# EAGLE design BOBORESP32S (EAGLE 7.6.0)
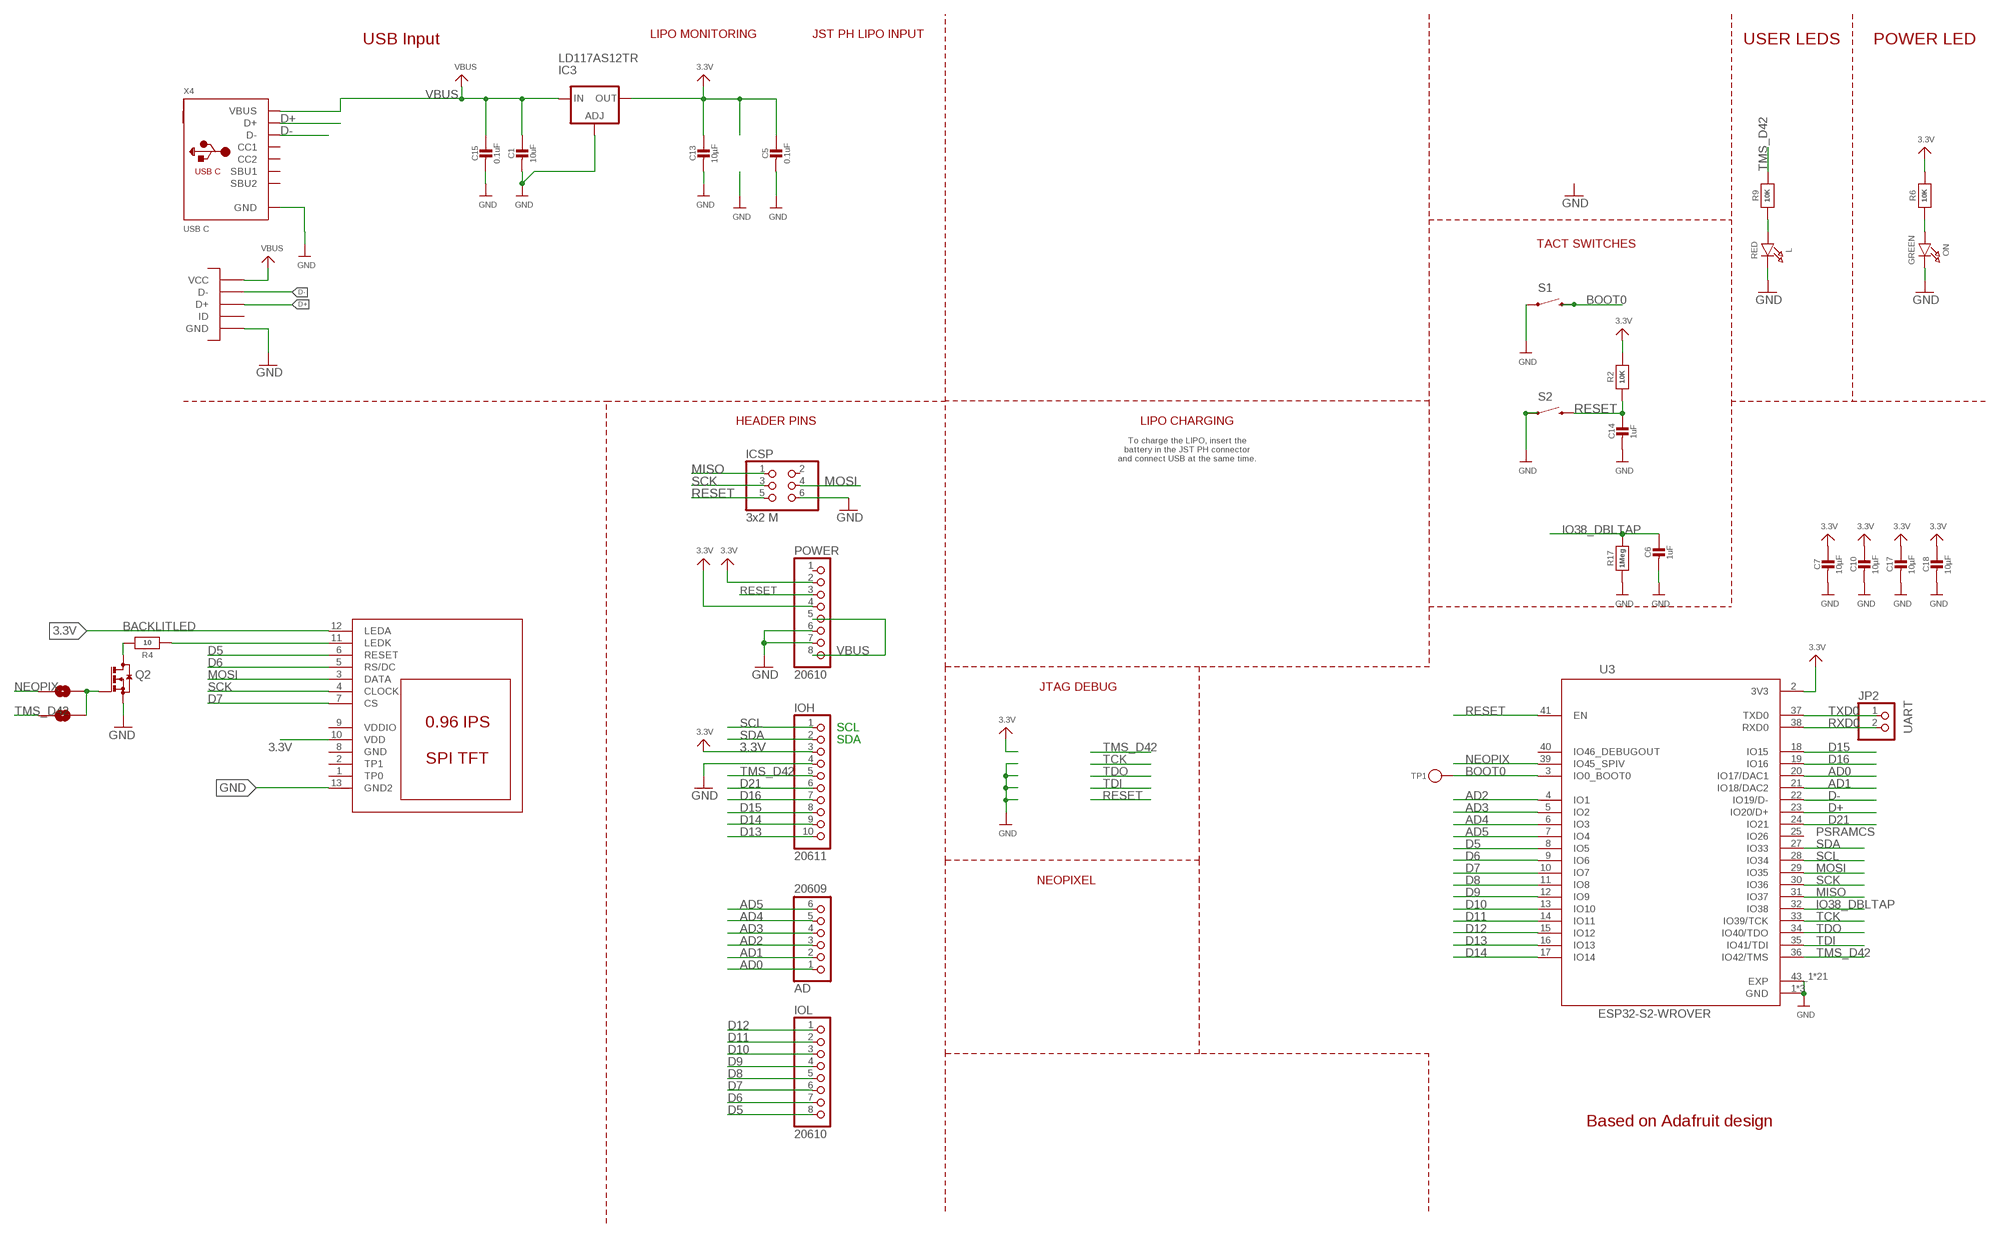
[diagram p0: schematic, sheet 1]

## Parts
AD  20609  HEADER-1X6OVALWAVE  [1X06_OVALWAVE]
C1  10uF  CAP_CERAMIC_0805  [_0805]
C5  0.1uF  CAP_CERAMIC_0805  [_0805]
C6  1uF  CAP_CERAMIC_0603  [_0603]
C7  10µF  CAP_CERAMIC_0805  [_0805]
C10  10µF  CAP_CERAMIC_0805  [_0805]
C13  10µF  CAP_CERAMIC_0805  [_0805]
C14  1uF  CAP_CERAMIC_0603  [_0603]
C15  0.1uF  CAP_CERAMIC_0603  [_0603]
C17  10µF  CAP_CERAMIC_0805  [_0805]
C18  10µF  CAP_CERAMIC_0805  [_0805]
IC3  LD117AS12TR  [SOT223]
ICSP  3x2 M  HEADER-2X3  [2X03_ROUND_70MIL]
IOH  20611  HEADER-1X10OVALWAVE  [1X10_OVALWAVE]
IOL  20610  HEADER-1X8OVALWAVE  [1X08_OVALWAVE]
JP2  UART  HEADER-1X2ROUND  [1X02_ROUND]
JUMPER1  SOLDERJUMPERTRACE  [SJ_2S-TRACE]
JUMPER2  SOLDERJUMPERNC2  [SJ_2S-NOTRACE]
L  RED  LED0603_NOOUTLINE  [CHIPLED_0603_NOOUTLINE]
ON  GREEN  LED0603_NOOUTLINE  [CHIPLED_0603_NOOUTLINE]
POWER  20610  HEADER-1X8OVALWAVE  [1X08_OVALWAVE]
Q2  BSS123  [SOT23]
R2  10K  RESISTOR_0603_NOOUT  [0603-NO]
R4  10  RESISTOR_0603_NOOUT  [0603-NO]
R6  10K  RESISTOR_0603_NOOUT  [0603-NO]
R9  10K  RESISTOR_0603_NOOUT  [0603-NO]
R17  1Meg  RESISTOR_0603_NOOUT  [0603-NO]
S1  SWITCH-MOMENTARY-2PTH  [TACTILE-PTH]
S2  SWITCH-MOMENTARY-2PTH  [TACTILE-PTH]
TP1  TESTPOINTROUND1.5MMNO  [TESTPOINT_ROUND_1.5MM_NO]
U3  ESP32-S2-WROVER  [MODULE_ESP32-S2-WROVER]
U$5  MICROUSB  [MICRO_B]
U$9  DISP_LCD_0.9IN_160X80  [TFT_0.96IN_160X80B]
X4  USB C  USB_C  [USB_C_CUSB31-CFM2AX-01-X]

## Nets
3.3V [Power]: C5.1 C7.1 C10.1 C13.1 C17.1 C18.1 IC3.4(OUT) IOH.3 POWER.2 POWER.4 R2.2 R6.2 U3.2(3V3) U$9.10(VDD) U$9.12(LEDA)
AD0: AD.1 U3.20(IO17/DAC1)
AD1: AD.2 U3.21(IO18/DAC2)
AD2: AD.3 U3.4(IO1)
AD3: AD.4 U3.5(IO2)
AD4: AD.5 U3.6(IO3)
AD5: AD.6 U3.7(IO4)
BACKLITLED: R4.1 U$9.11(LEDK)
BOOT0: S1.3 TP1.P$1 U3.3(IO0_BOOT0)
D5: IOL.8 U3.8(IO5) U$9.6(RESET)
D6: IOL.7 U3.9(IO6) U$9.5(RS/DC)
D7: IOL.6 U3.10(IO7) U$9.7(CS)
D8: IOL.5 U3.11(IO8)
D9: IOL.4 U3.12(IO9)
D10: IOL.3 U3.13(IO10)
D11: IOL.2 U3.14(IO11)
D12: IOL.1 U3.15(IO12)
D13: IOH.10 U3.16(IO13)
D14: IOH.9 U3.17(IO14)
D15: IOH.8 U3.18(IO15)
D16: IOH.7 U3.19(IO16)
D21: IOH.6 U3.24(IO21)
D+: U3.23(IO20/D+) U$5.P3(D+) X4.A6(D+) X4.B6(D+)
D-: U3.22(IO19/D-) U$5.P2(D-) X4.A7(D-) X4.B7(D-)
DISPBL: JUMPER1.1 JUMPER2.1 Q2.1(G)
GND [lowpower]: C1.2 C5.2 C6.2 C7.2 C10.2 C13.2 C14.2 C15.2 C17.2 C18.2 IC3.1(ADJ) ICSP.6 IOH.4 L.C ON.C POWER.6 POWER.7 Q2.2(S) R17.1 S1.1 S2.1 U3.1(GND) U3.26(GND) U3.42(GND) U3.43_1(EXP) U3.43_2(EXP) U3.43_3(EXP) U3.43_4(EXP) U3.43_5(EXP) U3.43_6(EXP) U3.43_7(EXP) U3.43_8(EXP) U3.43_9(EXP) U3.43_10(EXP) U3.43_11(EXP) U3.43_12(EXP) U3.43_13(EXP) U3.43_14(EXP) U3.43_15(EXP) U3.43_16(EXP) U3.43_17(EXP) U3.43_18(EXP) U3.43_19(EXP) U3.43_20(EXP) U3.43_21(EXP) U$5.GND1(GND) U$5.GND2(GND) U$5.GND3(GND) U$5.GND4(GND) U$5.GND7(GND) U$5.GND8(GND) U$5.P5(GND) U$9.13(GND2) X4.A1B12(GND) X4.B1A12(GND)
IO38_DBLTAP: C6.1 R17.2 U3.32(IO38)
MISO: ICSP.1 U3.31(IO37)
MOSI: ICSP.4 U3.29(IO35) U$9.3(DATA)
N$1: L.A R9.1
N$2: Q2.3(D) R4.2
N$3: ON.A R6.1
NEOPIX: JUMPER2.2 U3.39(IO45_SPIV)
RESET: C14.1 ICSP.5 POWER.3 R2.1 S2.3 U3.41(EN)
RXD0: JP2.2 U3.38(RXD0)
SCK: ICSP.3 U3.30(IO36) U$9.4(CLOCK)
SCL: IOH.1 U3.28(IO34)
SDA: IOH.2 U3.27(IO33)
TCK: U3.33(IO39/TCK)
TDI: U3.35(IO41/TDI)
TDO: U3.34(IO40/TDO)
TMS_D42: IOH.5 JUMPER1.2 R9.2 U3.36(IO42/TMS)
TXD0: JP2.1 U3.37(TXD0)
VBUS: C1.1 C15.1 IC3.3(IN) POWER.5 POWER.8 U$5.P1(VCC) X4.A4B9(VBUS) X4.B4A9(VBUS)
Unconnected: ICSP.2 POWER.1 U3.25(IO26) U3.40(IO46_DEBUGOUT) U$5.P4(ID) U$9.1(TP0) U$9.2(TP1) X4.A5(CC1) X4.A8(SBU1) X4.B5(CC2) X4.B8(SBU2)

## Notes on the sheet
- USB Input | LIPO MONITORING | JST PH LIPO INPUT | USER LEDS | POWER LED
- TACT SWITCHES
- HEADER PINS | LIPO CHARGING
- To charge the LIPO, insert the
  battery in the JST PH connector
  and connect USB at the same time.
- JTAG DEBUG
- SCL
- SDA
- PSRAMCS
- NEOPIXEL
- Based on Adafruit design

## Power pins joined to a net without a drawn wire
GND: U$9.8(GND)
VDDIO: U$9.9(VDDIO)

## Library data of the parts
AD = microbuilder:HEADER-1X6: PIN HEADER
C1 C5-C7 C10 C13-C15 C17 C18 = microbuilder:CAP_CERAMIC: Ceramic Capacitors For new designs, use the packages preceded by an '_' character since they are more reliable: The following footprints should be used on most boards: _0402 - Standard footprint for regular board layouts _0603 - Standard footprint for regular board layouts _0805 - Standard footprint for regular board layouts _1206 - Standard footprint for regular board layouts For extremely tight-pitch boards where space is at a premium, the following 'micro-pitch' footprints can be used (smaller pads, no silkscreen outline, etc.): _0402MP - Micro-pitch footprint for very dense/compact boards _0603MP - Micro-pitch footprint for very dense/compact boards _0805MP - Micro-pitch footprint for very dense/compact boards _1206MP - Micro-pitch footprint for very dense/compact boards
IC3 = v-reg:LD117A?*: Low drop fixed and adjustable positive voltage regulators 1 A Source: http://www.st.com/stonline/products/literature/ds/7194/ld1117axx.pdf
ICSP = microbuilder:HEADER-2X3: PIN HEADER
IOH = microbuilder:HEADER-1X10: PIN HEADER
IOL POWER = microbuilder:HEADER-1X8: PIN HEADER
JP2 = microbuilder:HEADER-1X2: PIN HEADER
JUMPER1 JUMPER2 = SparkFun:SOLDERJUMPER: Solder Jumper Standard SMD solder jumper. Used to automate production. Two varients : Normally Open and Normally Closed are the same, but have different paste layers. NC will have a large amount of paste and should jumper during reflow.
L ON = microbuilder:LED: LED 0603 - 0603 Surface Mount Package 2mA: Green LED - Low Power (3.9mcd, 2ma, 1.7Vf) - Digikey: 475-2709-2-ND Orange LED - Low Power (9.8mcd, 2ma, 1.8Vf) - Digikey: 475-1194-2-ND Red LED - Low Power (5mcd, 2ma, 1.8Vf) - Digikey: 475-1195-2-ND Yellow LED - Low Power (7mcd, 2ma, 1.8Vf) - Digikey: 475-1196-2-ND 5mA: Blue LED - Low Power (17mcd, 5ma, 2.9Vf) - Digikey: LNJ937W8CRACT-ND 0805 - 0805 Surface Mount Package 2mA: Red LED (8.8mcd, 2mA, 1.8Vf, Clear) - Low Power [Digikey: 475-2510-1-ND] Green LED (5mcd, 2mA, 1.8Vf, Clear) - Low Power [Digikey: 475-2730-1-ND] Yellow LED (11.3mcd, 2mA, 1.8Vf, Clear) - Low Power [Digikey: 475-2555-1-ND] 20mA: Red LED (104mcd, 20mA, Diffused) - LS R976 [Digikey: 475-1278-6-ND] Red LED (12mcd, 20mA, 2.0Vf, Clear) - APT2012EC [Digikey: 754-1128-1-ND] Green LED (15mcd, 20mA, 2.2Vf, Clear) - APT2012GC [Digikey: 754-1131-1-ND] Orange LED (160mcd, 20mA, 2.1Vf, Clear) - APT2012SECK [Digikey: 754-1130-1-ND] 1206 - 1206 Surface Mount Package Green LED (26mcd, 20mA, Diffused) - LG N971 [Digikey: 475-1407-6-ND] Red LED (15mcd, 20mA, Diffused) - LH N974 [Digikey: 475-1416-6-ND] Cree - Cree High-Power Surface Mount LEDs XPEBWT-L1-0000-00D50 - White 111lm 350mA 2.9Vf 6200K 110° XTEAWT-00-0000-00000LEE3 - White 114lm 350mA 2.85Vf 5000K 115° Everlight - Everlight 45-21 Series Surface Mount LEDs 45-21/QK2C-B2832AC2CB2/2T - Warm White 2000mcd 20mA 3.25Vf 3050K 120° 45-21/LK2C-B38452C4CB2/2T - Nuetral White 2000mcd 20mA 3.25Vf 4150K 120° 45-21/LK2C-B50634C6CB2/2T - Cold White 2200mcd 20mA 3.25Vf 5650K 120° PLCC2 Reverse Mount LS T77K-J1L2-1-0-2-R18-Z - Red 11.25mcd 2mA 1.8Vf 630nm 120° LO T77K-L1M2-24-Z - Orange 19.6mcd 2mA 1.8Vf 606nm 120° LY T77K-K2M1-26-Z - Yellow 15.7mcd 2mA 1.8Vf 587nm 120°
Q2 = transistor-small-signal:BSS123: N-CHANNEL MOS FET
R2 R4 R6 R9 R17 = microbuilder:RESISTOR: Resistors For new designs, use the packages preceded by an '_' character since they are more reliable: The following footprints should be used on most boards: _0402 - Standard footprint for regular board layouts _0603 - Standard footprint for regular board layouts _0805 - Standard footprint for regular board layouts _1206 - Standard footprint for regular board layouts For extremely tight-pitch boards where space is at a premium, the following 'micro-pitch' footprints can be used (smaller pads, no silkscreen outline, etc.): _0402MP - Micro-pitch footprint for very dense/compact boards _0603MP - Micro-pitch footprint for very dense/compact boards _0805MP - Micro-pitch footprint for very dense/compact boards _1206MP - Micro-pitch footprint for very dense/compact boards
S1 S2 = SparkFun-Electromechanical:SWITCH-MOMENTARY-2: Various NO switches- pushbuttons, reed, etc; PROD_ID: SWCH-08441
TP1 = microbuilder:TESTPOINT: Test Point Various test points for characterisation and PCB testing TESTPOINT_SMT - Compact Surface Mount Test Point [Digikey: 5016KTR-ND]
U3 = adafruit_wireless:ESP32-S2-WROVER: WiFi 802.11b/g/n Transceiver Module 2.4GHz Antenna Not Included Surface Mount Check prices <https://snapeda.com/parts/ESP32-S2-WROVER/Espressif%20Systems/view-part/?ref=eda>; AVAILABILITY: Warning; DESCRIPTION: WiFi 802.11b/g/n Transceiver Module 2.4GHz Antenna Not Included Surface Mount; DIGIKEY-PURCHASE-URL: https://snapeda.com/shop?store=DigiKey&id=4614060; MF: Espressif Systems; MP: ESP32-S2-WROVER; PACKAGE: VFQFN-56 Espressif Systems; PRICE: None
U$5 = Other:MICROUSB
U$9 = ips096bottom:DISP_LCD_0.9IN_160X80
X4 = microbuilder:USB_C: USB Type-C USB 2.0 Connector

## Net classes
2 lowpower: width 0.305 mm, drill 0.483 mm
3 Power: width 0.305 mm, drill 0.483 mm

## Board
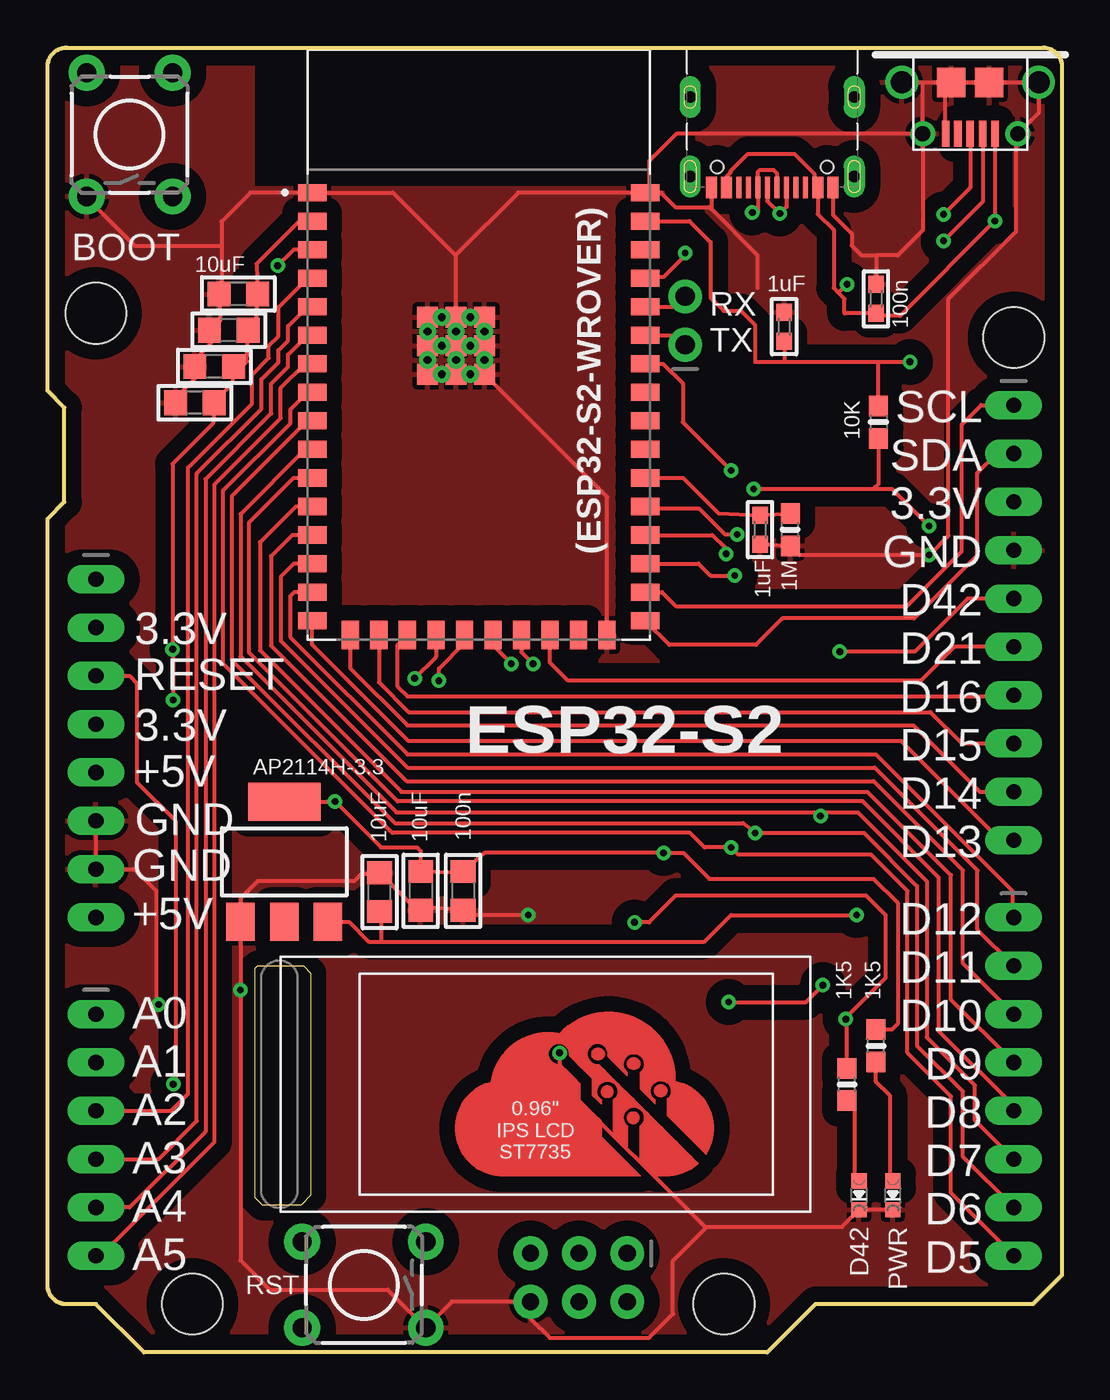
[diagram p1: board, top side]
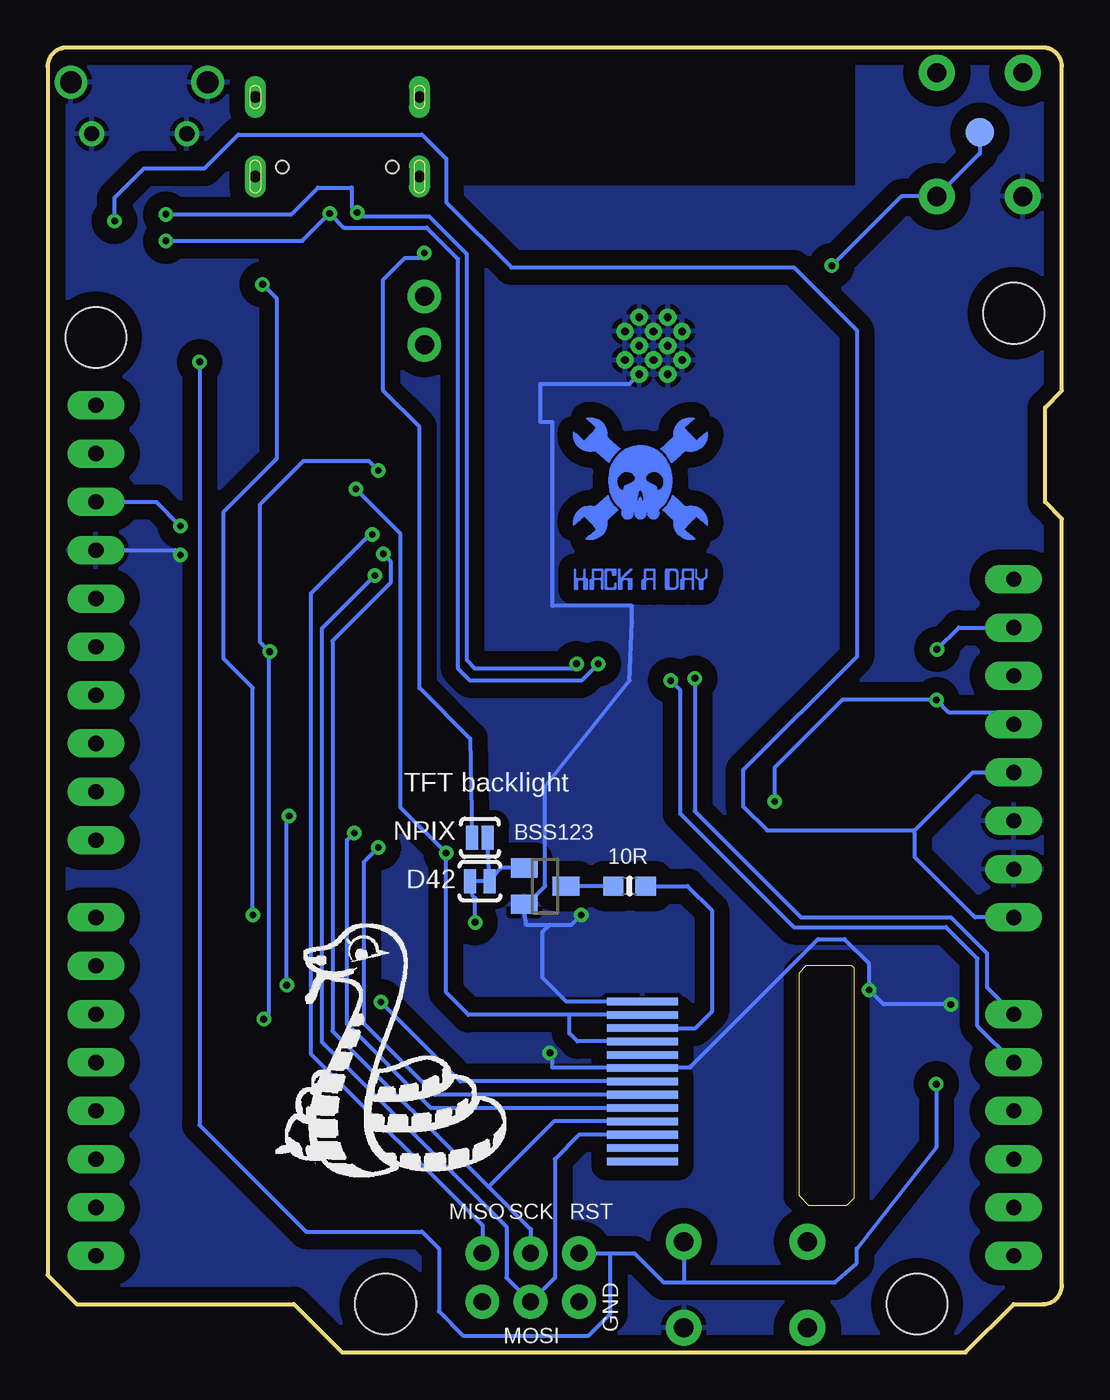
[diagram p2: board, bottom side, seen from below]

Size 53.34 x 68.58 mm. Coordinates in mm from the lower left corner, seen from the top.
Outline: 53.34,4.06 51.82,2.54 40.39,2.54 37.85,0 5.08,0 2.54,2.54 1,2.54 arc-90 0,3.54 0,43.81 0.89,44.7 0.89,49.66 0,50.55 0,67.58 arc-90 1,68.58 52.34,68.58 arc-90 53.34,67.58 53.34,4.06
Outline: 11.05,20.32 13.46,20.32 13.84,19.94 13.84,8.25 13.33,7.75 11.3,7.75 10.92,8.13 10.92,20.19 11.05,20.32
Copper layers (1*16): Top 0.035mm / dielectric 1.5mm / Bottom 0.035mm
Design rules "adafruit *": minimum track width 8mil, minimum drill 15.5mil, track to track 8mil, track to pad 8mil, pad to pad 8mil, via to via 8mil, smd to smd 8mil, copper to edge 10mil, drill to drill 8mil, minimum pad ring 10mil, minimum via ring 8mil, stop-mask expansion 2mil, vias tented up to drill 20mil, thermal gap 10mil
Holes 3.2 mm at 35.56,2.54 7.62,2.54 50.8,53.34 2.54,54.61

### Footprints (pad centres in the part's own frame; a part is rotated, then mirrored left to right if it is on the bottom)
1X06_OVALWAVE = drill 0.8 pad 1.5 long: 1 -6.35,0; 2 -3.81,0; 3 -1.27,0; 4 1.27,0; 5 3.81,0; 6 6.35,0
_0805 = smd 1.2 x 1.3: 1 -1.016,0; 2 1.016,0
_0603 = smd 0.9 x 0.8: 1 -0.762,0; 2 0.762,0
SOT223 = smd 1.5 x 2: 1 -2.3,-3.15; 2 0,-3.15; 3 2.3,-3.15 | smd 3.8 x 2: 4 0,3.15
2X03_ROUND_70MIL = drill 0.9 pad 1.778: 1 -2.54,-1.27; 2 -2.54,1.27; 3 0,-1.27; 4 0,1.27; 5 2.54,-1.27; 6 2.54,1.27
1X10_OVALWAVE = drill 0.8 pad 1.5 long: 1 -11.43,0; 2 -8.89,0; 3 -6.35,0; 4 -3.81,0; 5 -1.27,0; 6 1.27,0; 7 3.81,0; 8 6.35,0; 9 8.89,0; 10 11.43,0
1X08_OVALWAVE = drill 0.8 pad 1.5 long: 1 -8.89,0; 2 -6.35,0; 3 -3.81,0; 4 -1.27,0; 5 1.27,0; 6 3.81,0; 7 6.35,0; 8 8.89,0
1X02_ROUND = drill 1 pad 1.778: 1 -1.27,0; 2 1.27,0
SJ_2S-TRACE = smd 0.635 x 1.27: 1 -0.508,0; 2 0.508,0
SJ_2S-NOTRACE = smd 0.635 x 1.27: 1 -0.401,0; 2 0.413,0
CHIPLED_0603_NOOUTLINE = smd 0.8 x 0.8: A 0,-0.75; C 0,0.75
SOT23 = smd 1 x 1.4: 1 -0.95,-1.1; 2 0.95,-1.1; 3 0,1.1
0603-NO = smd 1.075 x 1: 1 -0.85,0; 2 0.85,0
TACTILE-PTH = drill 1.016 pad 1.88: 1 -3.251,2.261; 2 3.251,2.261; 3 -3.251,-2.261; 4 3.251,-2.261
TESTPOINT_ROUND_1.5MM_NO = smd 1.5 x 1.5: P$1 0,0
MODULE_ESP32-S2-WROVER = smd 1.5 x 0.9: 1 -8.75,8; 2 -8.75,6.5; 3 -8.75,5; 4 -8.75,3.5; 5 -8.75,2; 6 -8.75,0.5; 7 -8.75,-1; 8 -8.75,-2.5; 9 -8.75,-4; 10 -8.75,-5.5; 11 -8.75,-7; 12 -8.75,-8.5; 13 -8.75,-10; 14 -8.75,-11.5; 15 -8.75,-13; 16 -8.75,-14.5; 27 8.75,-14.5; 28 8.75,-13; 29 8.75,-11.5; 30 8.75,-10; 31 8.75,-8.5; 32 8.75,-7; 33 8.75,-5.5; 34 8.75,-4; 35 8.75,-2.5; 36 8.75,-1; 37 8.75,0.5; 38 8.75,2; 39 8.75,3.5; 40 8.75,5; 41 8.75,6.5; 42 8.75,8 | smd 0.9 x 1.5: 17 -6.75,-15.25; 18 -5.25,-15.25; 19 -3.75,-15.25; 20 -2.25,-15.25; 21 -0.75,-15.25; 22 0.75,-15.25; 23 2.25,-15.25; 24 3.75,-15.25; 25 5.25,-15.25; 26 6.75,-15.25 | smd 1.1 x 1.1: 43_1 -2.69,1.45; 43_2 -1.19,1.45; 43_3 0.31,1.45; 43_4 -2.69,-0.05; 43_5 -1.19,-0.05; 43_6 0.31,-0.05; 43_7 -2.69,-1.55; 43_8 -1.19,-1.55; 43_9 0.31,-1.55 | drill 0.4: 43_10 -1.94,1.45; 43_11 -0.44,1.45; 43_12 -2.69,0.7; 43_13 -1.19,0.7; 43_14 0.31,0.7; 43_15 -1.94,-0.05; 43_16 -0.44,-0.05; 43_17 -2.69,-0.8; 43_18 -1.19,-0.8; 43_19 0.31,-0.8; 43_20 -1.94,-1.55; 43_21 -0.44,-1.55
MICRO_B = smd 1.5 x 1.55: GND1 -1,1.45; GND2 1,1.45 | drill 0.8: GND3 -2.5,4.15; GND4 2.5,4.15 | drill 1.15: GND7 -3.598,1.45; GND8 3.598,1.45 | smd 0.4 x 1.35: P1 -1.3,4.15; P2 -0.65,4.15; P3 0,4.15; P4 0.65,4.15; P5 1.3,4.15
TFT_0.96IN_160X80B = smd 3.74 x 0.4 bottom: 1 10.5,3.565; 2 10.5,4.265; 3 10.5,4.965; 4 10.5,5.665; 5 10.5,6.365; 6 10.5,7.065; 7 10.5,7.765; 8 10.5,8.465; 9 10.5,9.165; 10 10.5,9.865; 11 10.5,10.565; 12 10.5,11.265; 13 10.5,11.965
USB_C_CUSB31-CFM2AX-01-X = smd 0.575 x 1.15: A1B12 -3.2,3.545; A4B9 -2.4,3.545; B1A12 3.2,3.545; B4A9 2.4,3.545 | smd 0.275 x 1.15: A5 -1.25,3.545; A6 -0.25,3.545; A7 0.25,3.545; A8 1.25,3.545; B5 1.75,3.545; B6 0.75,3.545; B7 -0.75,3.545; B8 -1.75,3.545 | drill 0.6 pad 1 long: M1 -4.32,2.97; M2 4.32,2.97; M3 -4.32,-1.21; M4 4.32,-1.21 | hole 0.65: 2.89,2.47; -2.89,2.47

### Placement (x,y rotation side)
AD  2.54,11.43 270 top
C1  17.46,24.19 90 top
C5  21.84,24.26 270 top
C6  37.46,43.24 270 top
C7  10.03,55.63 180 top
C10  9.53,53.72 180 top
C13  19.62,24.26 270 top
C14  38.73,53.91 90 top
C15  43.56,55.37 90 top
C17  8.76,51.82 180 top
C18  7.75,49.91 180 top
IC3  12.45,25.78 0 top
ICSP  27.94,3.94 180 top
IOH  50.8,38.35 270 top
IOL  50.8,13.97 270 top
JP2  33.53,54.23 90 top
JUMPER1  30.61,24.77 180 bottom
JUMPER2  30.61,27.05 180 bottom
L  42.67,8.25 180 top
ON  44.45,8.25 180 top
POWER  2.54,31.75 270 top
Q2  27.18,24.51 270 bottom
R2  43.69,48.89 270 top
R4  22.73,24.51 180 bottom
R6  43.56,16.12 90 top
R9  42.04,14.08 90 top
R17  39.05,43.24 90 top
S1  4.32,64.01 90 top
S2  16.64,3.56 180 top
TP1  4.32,64.14 0 bottom
U3  22.67,52.96 0 top
U$5  48.51,68.2 180 top
U$9  11.56,6.48 0 top
X4  38.1,64.77 180 top

### Tracks (layer width: path | path; a pad name or v marks a point on that pad's centre or on a via)
3.3V  (via drill 0.36)
  Top 0.203: U3.2 13.23,59.46 10.98,57.21 C7.1 10.98,54.23 C10.1 10.47,52.07 10.22,51.82 C17.1 9.71,50.93 C18.1 8.7,48.83 6.57,46.71 v6.57,36.96 6.6,36.93 v6.6,34.29 | 43.61,17.02 R6.2 44.4,16.97 44.7,17.27 44.7,23.62 43.43,24.89 34.8,24.89 33.44,26.25 v32.38,26.25 22.99,26.25 C5.1 21.49,25.21 C13.1 19.62,26.35 19.43,26.54 17.53,26.54 v15.11,28.96 15.09,28.93 IC3.4 | v37.13,45.38 43.43,45.38 | 43.43,45.38 44.4,45.38 v46.35,43.43 | R2.2 43.69,45.64 43.43,45.38
  Bottom 0.203: v6.57,36.96 5.43,38.1 POWER.2 | POWER.4 3.17,33.65 5.97,33.65 v6.6,34.29 11.56,34.29 15.11,30.73 v15.11,28.96 | IOH.3 47.62,44.7 v46.35,43.43 | v37.13,45.38 34.8,43.05 34.8,28.66 v32.38,26.25 32.38,18.92 31.2,17.74 25.91,17.74 | U$9.12 25.91,17.74 | U$9.10 25.49,16.34 25.91,16.76 25.91,17.74
AD0  (via drill 0.36)
  Top 0.203: v19.3,35.43 20.42,36.55 U3.20
  Bottom 0.203: v19.3,35.43 19.3,28.45 13.72,22.86 5.84,22.86 3.94,20.96 3.94,19.18 AD.1
AD1  (via drill 0.36)
  Top 0.203: U3.21 21.92,37.29 20.57,35.94 v20.57,35.31
  Bottom 0.203: v20.57,35.31 20.07,34.8 20.07,28.32 14.1,22.35 6.1,22.35 4.45,20.7 4.45,17.14 AD.2
AD2
  Top 0.203: AD.3 6.5,12.7 7.39,13.59 7.39,46.51 10.74,49.86 10.74,51.38 11.63,52.27 11.63,52.9 12.14,53.41 12.14,54.93 13.67,56.46 U3.4
AD3
  Top 0.203: AD.4 5.84,10.16 7.85,12.17 7.85,46.2 11.25,49.61 11.25,51.15 12.14,52.04 12.14,52.67 12.65,53.18 12.65,53.94 13.67,54.96 U3.5
AD4
  Top 0.203: AD.5 4.32,7.62 8.31,11.61 8.31,45.9 11.76,49.35 11.76,50.92 12.65,51.81 12.65,52.44 13.67,53.46 U3.6
AD5
  Top 0.203: AD.6 2.79,5.08 8.76,11.05 8.76,45.59 12.27,49.1 12.27,50.69 13.54,51.96 U3.7
BACKLITLED
  Bottom 0.203: R4.1 19.69,24.51 18.42,23.24 18.42,17.91 19.3,17.02 22.03,17.02 U$9.11
BOOT0  (via drill 0.36)
  Top 0.203: U3.3 12.95,57.96 v12.1,57.11
  Bottom 0.203: v12.1,57.11 8.46,60.76 S1.3 4.32,63.02 TP1.P$1
D5  (via drill 0.36)
  Top 0.203: IOL.8 47.5,8.38 47.5,13.46 45.21,15.75 45.21,24.26 43.31,26.16 36.32,26.16 v35.94,26.54 34.54,26.54 33.78,27.3 18.13,27.3 9.23,36.2 9.23,45.3 12.78,48.84 12.78,49.57 13.54,50.34 13.8,50.34 U3.8
  Bottom 0.203: U$9.6 32.97,13.54 36.7,17.27 36.7,25.78 v35.94,26.54
D6  (via drill 0.36)
  Top 0.203: IOL.7 48.13,10.29 48.13,13.72 45.72,16.13 45.72,24.51 42.93,27.3 v37.21,27.3 36.58,27.81 18.27,27.81 9.69,36.39 9.69,45 13.53,48.83 13.79,48.83 U3.9
  Bottom 0.203: U$9.5 33.16,12.84 37.59,17.27 37.59,26.92 v37.21,27.3
D7  (via drill 0.36)
  Top 0.203: U3.10 13.55,47.46 10.15,44.06 10.15,36.58 18.34,28.39 40.64,28.39 | 40.64,28.39 42.61,28.39 46.23,24.77 46.23,16.57 48.77,14.03 48.77,12.19 IOL.6 | v35.81,18.42 39.88,18.42 v40.77,19.3 | v40.64,28.19 40.64,28.39
  Bottom 0.203: U$9.7 31.64,14.24 v35.81,18.42 | v40.77,19.3 40.77,28.07 v40.64,28.19
D8
  Top 0.203: U3.11 12.94,45.96 10.61,43.62 10.61,36.77 18.42,28.96 42.86,28.96 46.86,24.96 46.86,16.89 50.8,12.95 IOL.5
D9
  Top 0.203: U3.12 13.05,44.46 11.18,42.58 11.18,36.89 18.61,29.46 43.12,29.46 47.5,25.08 47.5,18.54 IOL.4
D10
  Top 0.203: U3.13 12.86,42.96 11.75,41.85 11.75,37.15 18.87,30.02 43.45,30.02 48.13,25.34 48.13,20.45 IOL.3
D11
  Top 0.203: U3.14 12.95,41.46 12.26,40.77 12.26,37.4 18.92,30.73 43.5,30.73 48.89,25.34 48.89,22.23 IOL.2
D12
  Top 0.203: U3.15 12.97,39.96 12.76,39.75 12.76,37.59 18.92,31.43 43.56,31.43 50.74,24.26 50.74,22.92 IOL.1
D13
  Top 0.203: IOH.10 50.1,26.92 44.89,32.13 18.99,32.13 13.92,37.2 U3.16
D14
  Top 0.203: U3.17 15.92,35.96 18.92,32.96 45.53,32.96 49.02,29.46 IOH.9
D15
  Top 0.203: U3.18 17.42,35.22 18.99,33.65 46.42,33.65 48.07,32 IOH.8
D16
  Top 0.203: U3.19 18.41,37.2 18.41,34.99 18.92,34.48 50.74,34.48 IOH.7
D21
  Top 0.203: IOH.6 47.69,37.08 45.91,35.31 27.37,35.31 26.42,36.25 U3.24
D+  (via drill 0.36)
  Top 0.203: U3.23 24.92,36.8 v25.53,36.2 | v37.06,59.91 37.35,59.91 X4.B6 37.35,62.04 37.46,62.15 38.18,62.15 38.35,61.98 X4.A6 | U$5.P3 48.51,61.21 v47.12,59.82
  Bottom 0.203: v25.53,36.2 25.78,35.94 30.85,35.94 31.29,36.38 31.29,57.72 33.27,59.7 36.86,59.7 v37.06,59.91 37.35,60.2 X4.B6 39.12,61.21 40.51,59.82 v47.12,59.82
D-  (via drill 0.36)
  Top 0.203: U3.22 23.42,37.16 v24.38,36.2 | X4.B7 38.85,60.21 v38.5,59.86 37.85,60.51 X4.A7 | U$5.P2 49.16,60.47 v47.12,58.42
  Bottom 0.203: v24.38,36.2 25.27,35.31 31.12,35.31 31.75,35.94 31.75,57.47 33.4,59.12 37.76,59.12 v38.5,59.86 39.94,58.42 v47.12,58.42
DISPBL
  Bottom 0.203: Q2.1 29.51,25.46 JUMPER1.1 30.21,26.94 JUMPER2.1
GND  (via drill 0.36)
  Top 0.203: C18.2 6.8,50.23 7.81,51.25 C17.2 7.81,52.26 8.57,53.02 C10.2 9.08,54.23 C7.2 9.14,55.69 9.14,58.17 | 9.14,58.17 9.14,59.44 10.67,60.96 U3.1 18.16,60.96 21.46,57.66 | S1.1 2.06,60.68 4.57,58.17 9.14,58.17 | 21.46,57.66 21.46,54.43 U3.43_2 | C6.2 R17.1 39.54,41.91 v46.35,41.91 47.37,42.93 47.37,55.37 50.93,58.93 50.93,63.96 U$5.GND3 52.11,65.15 U$5.GND7 52.04,66.68 51.43,66.68 51.36,66.75 U$5.GND1 U$5.GND2 | U3.26 29.42,44.97 U3.43_9 U3.43_21 U3.43_8 | ON.C L.C 41.77,6.6 34.67,6.6 34.61,6.54 | U$5.GND8 46.1,66.75 | 46.1,66.75 U$5.GND2 | U$5.P5 47.21,66.45 U$5.GND2 | U$5.GND4 46.01,66.66 46.1,66.75 | U$5.GND4 46.01,58.97 44.7,57.66 43.59,57.66 43.59,56.25 C15.2 | X4.A1B12 41.3,59.79 42.29,58.8 42.29,58.17 42.8,57.66 43.54,57.66 | X4.B1A12 34.9,60.1 | 34.9,60.1 37.34,57.66 37.34,55.95 | U3.42 32.26,60.96 33.02,60.2 34.8,60.2 34.9,60.1 | U$5.GND4 33.06,64.05 31.62,62.61 31.62,61.16 U3.42 | POWER.6 POWER.7 4.57,25.4 5.71,24.26 5.71,18.42 v5.84,18.29 | 34.61,6.54 32.89,4.83 32.89,2.03 31.62,0.76 26.42,0.76 25.4,1.78 ICSP.6 21.26,2.67 S2.1 17.88,3.3 11.68,3.3 10.15,4.84 v10.15,19.05 IC3.1 10.16,22.64 10.16,23.88 11.05,24.77 16.13,24.77 16.51,25.15 17.4,25.15 C1.2 19.43,23.24 C13.2 19.98,23.41 C5.2 22.26,22.99 v25.27,22.99 | v26.92,15.75 26.92,14.22 34.61,6.54 | U3.43_2 U3.43_10 U3.43_1 U3.43_12 | U3.43_2 U3.43_11 22.28,54.36 22.86,54.36 | U3.43_3 22.91,54.41 22.86,54.36 | 22.86,54.36 22.99,54.36 U3.43_14 U3.43_6 | U3.43_6 U3.43_16 U3.43_5 | U3.43_5 U3.43_15 U3.43_4 | U3.43_5 U3.43_13 | U3.43_5 U3.43_18 U3.43_8 | U3.43_8 U3.43_20 U3.43_7 U3.43_17 | U3.43_6 U3.43_19 | U3.42 24.76,60.96 21.46,57.66
  Bottom 0.203: IOH.4 46.61,42.16 v46.35,41.91 | 22.1,14.99 26.8,14.99 26.8,15.62 v26.92,15.75 | 22.1,14.99 U$9.8 | v5.84,18.29 9.38,18.29 v10.15,19.05 | 26.92,22.48 28.19,22.48 28.28,23.07 Q2.2 28.13,23.56 27.18,24.51 27.18,29.72 22.73,35.31 22.61,38.35 22.61,39.24 26.8,39.24 26.8,48.89 27.43,48.89 27.43,50.9 22.73,50.9 U3.43_21 | 26.92,22.48 25.78,22.48 v25.27,22.99 | 22.1,14.99 19.56,14.99 12.83,21.72 11.43,21.72 10.16,20.45 10.16,19.05 | U$9.13 26.06,18.44 27.3,19.69 27.3,22.1 26.92,22.48
  pour Top (isolate 0.813, rank 3): 53.47,68.58 53.47,0 0,0 0,68.58 10.79,68.58 10.79,61.21 34.16,61.21 34.16,68.58
  pour Bottom (isolate 0.813, rank 3): 53.47,68.58 53.47,0 0,0 0,68.58 10.79,68.58 10.79,61.21 34.16,61.21 34.16,68.58
IO38_DBLTAP
  Top 0.203: U3.32 33.42,45.96 35.28,44.09 C6.1 R17.2
MISO  (via drill 0.36)
  Top 0.203: U3.31 31.55,44.33 34.28,44.33 35.62,42.99 v36.26,42.99
  Bottom 0.203: v36.26,42.99 36.39,42.99 39.5,39.88 39.5,15.7 30.48,6.68 ICSP.1
MOSI  (via drill 0.36)
  Top 0.203: U3.29 34.23,41.46 34.86,40.83 v36.13,40.83
  Bottom 0.203: v36.13,40.83 38.93,38.04 38.93,16.32 29.21,6.6 29.21,3.94 ICSP.4 26.67,3.94 26.67,10.16 25.39,11.44 U$9.3
N$1
  Top 0.203: L.A 42.42,9.02 42.42,12.85 R9.1
N$2
  Bottom 0.203: R4.2 Q2.3
N$3
  Top 0.203: ON.A 44.28,9.11 44.28,13.51 43.56,14.24 R6.1
NEOPIX  (via drill 0.36)
  Top 0.203: v33.53,57.78 33.53,57.66 32.38,56.52 31.48,56.52 U3.39
  Bottom 0.203: v33.53,57.78 33.78,57.53 34.54,57.53 35.69,56.39 35.69,50.55 33.78,48.64 33.78,34.92 31.12,32.26 JUMPER2.2
RESET  (via drill 0.36)
  Top 0.203: U3.41 33.76,59.46 34.86,58.36 34.86,55.43 35.56,54.74 36.45,54.74 37.21,53.97 37.21,52.06 38.73,52.06 | POWER.3 4.32,35.56 4.7,35.18 4.7,29.97 6.73,27.94 6.73,14.22 v6.61,14.1 | 38.73,52.06 43.69,52.06 | 43.69,52.06 v45.34,52.06 v45.34,52.07 | R2.1 43.69,52.06 | C14.1 38.73,52.06
  Bottom 0.203: v6.61,14.1 6.61,10.79 10.79,5.46 10.79,4.7 11.94,3.68 19.94,3.68 | ICSP.5 23.75,5.21 | 23.75,5.21 22.48,5.21 20.96,3.68 19.94,3.68 | 23.75,5.21 23.75,2.03 24.89,0.89 31.5,0.89 32.77,2.16 32.77,5.46 33.66,6.35 39.75,6.35 45.34,11.94 v45.34,52.07 | S2.3 19.89,3.73 19.94,3.68
RXD0
  Top 0.203: U3.38 32.99,54.96 JP2.2
SCK  (via drill 0.36)
  Top 0.203: U3.30 34.96,42.96 35.69,42.23 v35.69,41.97
  Bottom 0.203: v35.69,41.97 35.31,41.59 35.31,40.45 38.35,37.4 38.35,16.89 30.16,8.7 | 30.16,8.7 27.94,6.48 ICSP.3 | U$9.4 26.72,12.14 30.16,8.7
SCL
  Top 0.203: U3.28 32.31,39.96 33.07,39.2 45.17,39.2 48.07,42.1 48.07,48.77 49.09,49.78 IOH.1
SDA
  Top 0.203: IOH.2 49.91,47.24 48.89,46.23 48.89,41.91 45.57,38.59 38.65,38.59 37.25,37.19 32.69,37.19 U3.27
  Bottom 0.203: 49.53,47.24 IOH.2
TMS_D42  (via drill 0.36)
  Top 0.203: 35.97,46.39 v35.94,46.35 33.4,48.89 33.4,50.93 32.37,51.96 U3.36 | IOH.5 48.39,39.62 45.59,36.83 v41.66,36.83 | R9.2 42.04,17.45 v41.97,17.51 41.97,17.59 44.07,19.69 44.07,22.99 43.05,24 33.02,24 31.62,22.61 v30.86,22.61
  Bottom 0.203: v41.97,17.51 41.72,17.77 41.72,36.77 v41.66,36.83 42.16,37.34 42.16,44.58 39.88,46.86 36.45,46.86 v35.94,46.35 | v30.86,22.61 30.86,23.88 31.02,24.04 JUMPER1.2
TXD0
  Top 0.203: U3.37 33.03,53.46 JP2.1
VBUS  (via drill 0.36)
  Top 0.203: X4.B4A9 35.7,61.79 35.92,62.01 35.92,62.08 36.83,62.99 39.26,62.99 40.32,61.94 40.32,61.41 X4.A4B9 40.5,59.83 41.34,58.99 41.34,55.95 41.59,55.69 | 41.59,55.69 41.91,55.37 41.91,54.61 C15.1 43.6,54.48 44.83,54.48 v49.81,59.47 U$5.P1 | IC3.3 15.85,22.63 16.89,21.59 17.53,21.59 | 17.53,21.59 34.54,21.59 35.94,22.99 v42.54,22.99 | v42.04,56.13 41.59,55.69 | C1.1 17.53,23.11 17.53,21.59
  Bottom 0.203: v42.54,22.99 42.54,34.92 44.07,36.45 44.07,44.2 41.27,46.99 41.27,55.37 v42.04,56.13 | v49.81,59.47 49.81,60.68 48.26,62.23 45.09,62.23 43.31,64.01 33.66,64.01 32.38,62.74 32.38,60.45 28.96,57.02 14.1,57.02 10.79,53.72 10.79,36.58 16.76,30.61 16.76,28.7 15.49,27.43 7.87,27.43 | 7.87,27.43 7.75,27.43 4.7,30.48 POWER.5 | POWER.8 4.57,22.86 7.75,26.04 7.75,27.3 7.87,27.43
(copper drawn outside any net)
  shapes: Bottom area x1350, Top area x1225

### Text on the board
tNames: (ESP32-S2-WROVER) | BOOT | 10uF | 100n | 1uF | RX / TX | SCL | 10K | SDA | 3.3V | GND | 1uF | 1M | D42 | D21 | 3.3V | RESET | D16 | D15 | 3.3V | ESP32-S2 | +5V | AP2114H-3.3 | 10uF | 10uF | 100n | D14 | D13 | GND | GND | D12 | +5V | D11 | 1K5 | 1K5 | D10 | A0 | D9 | A1 | D8 | A2 | 0.96" / IPS LCD / ST7735 | D7 | A3 | D6 | A4 | D42 | PWR | D5 | A5 | RST
bNames: TFT backlight | NPIX | BSS123 | 10R | D42 | RST | SCK | MISO | GND | MOSI
tStop: AISLER.NET
bStop: WWW.PeMi.Technology
214bmp: D:/SmartProjects/Snc/a4_bn_logo2.bmp